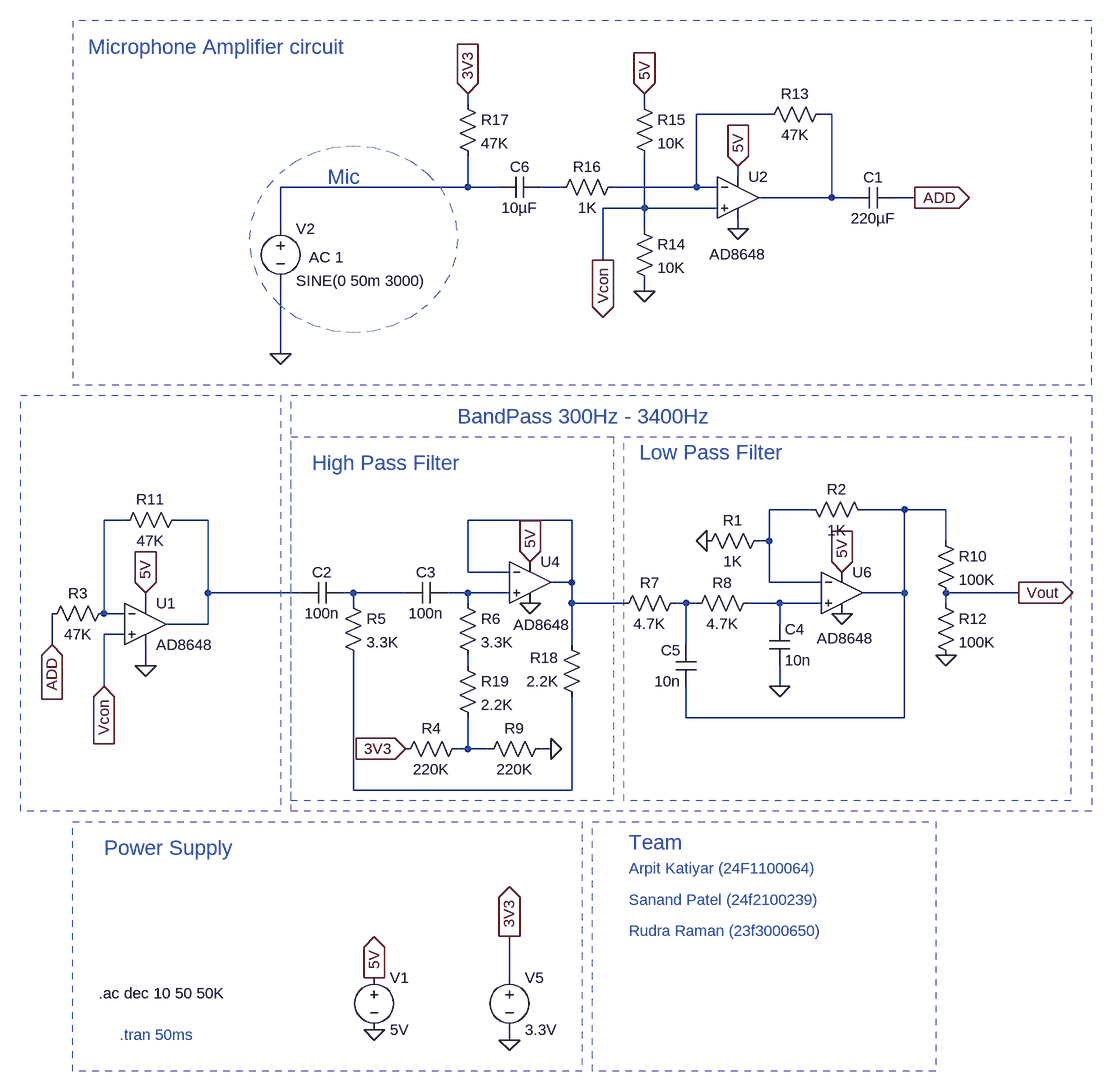
[diagram p0: schematic ESP_SIGNAL_CONDITIONING.asc]
ESP_SIGNAL_CONDITIONING.asc, the LTspice schematic file:
Version 4
SHEET 1 1856 948
WIRE 144 -1280 144 -1296
WIRE 416 -1280 416 -1296
WIRE 608 -1264 496 -1264
WIRE 704 -1264 688 -1264
WIRE 560 -1168 560 -1184
WIRE 144 -1152 144 -1200
WIRE 144 -1152 -144 -1152
WIRE 192 -1152 144 -1152
WIRE 288 -1152 256 -1152
WIRE 496 -1152 496 -1264
WIRE 496 -1152 368 -1152
WIRE 528 -1152 496 -1152
WIRE 704 -1136 704 -1264
WIRE 704 -1136 592 -1136
WIRE 736 -1136 704 -1136
WIRE 832 -1136 800 -1136
WIRE 416 -1120 416 -1200
WIRE 416 -1120 352 -1120
WIRE 528 -1120 416 -1120
WIRE -144 -1088 -144 -1152
WIRE 416 -1088 416 -1120
WIRE 560 -1088 560 -1104
WIRE 352 -1040 352 -1120
WIRE 416 -992 416 -1008
WIRE -144 -896 -144 -1008
WIRE 672 -656 608 -656
WIRE 816 -656 752 -656
WIRE 880 -656 816 -656
WIRE -384 -640 -416 -640
WIRE -256 -640 -304 -640
WIRE 304 -640 144 -640
WIRE 608 -608 608 -656
WIRE 608 -608 592 -608
WIRE 880 -608 880 -656
WIRE 144 -560 144 -640
WIRE 208 -560 144 -560
WIRE 304 -544 304 -640
WIRE 304 -544 272 -544
WIRE 608 -544 608 -608
WIRE 688 -544 608 -544
WIRE -256 -528 -256 -640
WIRE -112 -528 -256 -528
WIRE -32 -528 -48 -528
WIRE 48 -528 -32 -528
WIRE 144 -528 112 -528
WIRE 208 -528 144 -528
WIRE 816 -528 816 -656
WIRE 816 -528 752 -528
WIRE 992 -528 880 -528
WIRE -352 -512 -352 -528
WIRE -32 -512 -32 -528
WIRE 144 -512 144 -528
WIRE 304 -512 304 -544
WIRE 384 -512 304 -512
WIRE 480 -512 464 -512
WIRE 496 -512 480 -512
WIRE 624 -512 576 -512
WIRE 688 -512 624 -512
WIRE 880 -512 880 -528
WIRE -416 -496 -416 -640
WIRE -384 -496 -416 -496
WIRE -256 -480 -256 -528
WIRE -256 -480 -320 -480
WIRE 624 -480 624 -512
WIRE -384 -464 -416 -464
WIRE -496 -448 -496 -496
WIRE 304 -448 304 -512
WIRE 480 -448 480 -512
WIRE -352 -416 -352 -448
WIRE 144 -416 144 -432
WIRE -416 -384 -416 -464
WIRE 624 -384 624 -416
WIRE 480 -336 480 -384
WIRE 816 -336 816 -528
WIRE 816 -336 480 -336
WIRE 144 -288 144 -336
WIRE 144 -288 128 -288
WIRE 176 -288 144 -288
WIRE 272 -288 256 -288
WIRE -32 -224 -32 -432
WIRE 304 -224 304 -368
WIRE 304 -224 -32 -224
WIRE 208 64 208 0
WIRE 208 160 208 144
FLAG 0 144 0
FLAG 0 64 5V
IOPIN 0 64 Out
FLAG -144 -896 0
FLAG 240 -512 0
FLAG 720 -496 0
FLAG 240 -576 5V
IOPIN 240 -576 In
FLAG 720 -560 5V
IOPIN 720 -560 In
FLAG 992 -528 Vout
IOPIN 992 -528 Out
FLAG 512 -608 0
FLAG 624 -384 0
FLAG 880 -432 0
FLAG 560 -1088 0
FLAG 560 -1184 5V
IOPIN 560 -1184 In
FLAG 416 -992 0
FLAG 416 -1296 5V
IOPIN 416 -1296 In
FLAG 144 -1296 3V3
IOPIN 144 -1296 In
FLAG -352 -416 0
FLAG -352 -528 5V
IOPIN -352 -528 In
FLAG 832 -1136 ADD
IOPIN 832 -1136 Out
FLAG -496 -448 ADD
IOPIN -496 -448 In
FLAG 208 160 0
FLAG 208 0 3V3
IOPIN 208 0 Out
FLAG 352 -1040 Vcon
IOPIN 352 -1040 Out
FLAG -416 -384 Vcon
IOPIN -416 -384 In
FLAG 272 -288 0
FLAG 48 -288 3V3
IOPIN 48 -288 In
SYMBOL voltage 0 48 R0
WINDOW 123 0 0 Left 0
WINDOW 39 0 0 Left 0
SYMATTR InstName V1
SYMATTR Value 5V
SYMBOL res 656 -672 M90
WINDOW 0 0 56 VBottom 2
WINDOW 3 32 56 VTop 2
SYMATTR InstName R2
SYMATTR Value 1K
SYMBOL voltage -144 -1104 R0
WINDOW 123 44 60 Left 2
WINDOW 39 0 0 Left 0
SYMATTR Value2 AC 1
SYMATTR InstName V2
SYMATTR Value SINE(0 50m 3000)
SYMBOL res 496 -592 R270
WINDOW 0 32 56 VTop 2
WINDOW 3 0 56 VBottom 2
SYMATTR InstName R1
SYMATTR Value 1K
SYMBOL cap -48 -544 R90
WINDOW 0 0 32 VBottom 2
WINDOW 3 32 32 VTop 2
SYMATTR InstName C2
SYMATTR Value 100n
SYMBOL cap 112 -544 R90
WINDOW 0 0 32 VBottom 2
WINDOW 3 32 32 VTop 2
SYMATTR InstName C3
SYMATTR Value 100n
SYMBOL res -48 -528 R0
SYMATTR InstName R5
SYMATTR Value 3.3K
SYMBOL res 128 -528 R0
SYMATTR InstName R6
SYMATTR Value 3.3K
SYMBOL res 480 -528 R90
WINDOW 0 0 56 VBottom 2
WINDOW 3 32 56 VTop 2
SYMATTR InstName R7
SYMATTR Value 4.7K
SYMBOL res 592 -528 R90
WINDOW 0 0 56 VBottom 2
WINDOW 3 32 56 VTop 2
SYMATTR InstName R8
SYMATTR Value 4.7K
SYMBOL cap 608 -480 R0
SYMATTR InstName C4
SYMATTR Value 10n
SYMBOL cap 496 -384 R180
WINDOW 0 24 56 Left 2
WINDOW 3 24 8 Left 2
SYMATTR InstName C5
SYMATTR Value 10n
SYMBOL res 864 -624 R0
SYMATTR InstName R10
SYMATTR Value 100K
SYMBOL res 864 -528 R0
SYMATTR InstName R12
SYMATTR Value 100K
SYMBOL res 704 -1280 R90
WINDOW 0 0 56 VBottom 2
WINDOW 3 32 56 VTop 2
SYMATTR InstName R13
SYMATTR Value 47K
SYMBOL res 400 -1104 R0
SYMATTR InstName R14
SYMATTR Value 10K
SYMBOL res 400 -1296 R0
SYMATTR InstName R15
SYMATTR Value 10K
SYMBOL res 384 -1168 R90
WINDOW 0 0 56 VBottom 2
WINDOW 3 32 56 VTop 2
SYMATTR InstName R16
SYMATTR Value 1K
SYMBOL cap 256 -1168 R90
WINDOW 0 0 32 VBottom 2
WINDOW 3 32 32 VTop 2
SYMATTR InstName C6
SYMATTR Value 10µF
SYMBOL res 128 -1296 R0
SYMATTR InstName R17
SYMATTR Value 47K
SYMBOL OpAmps\\AD8648 560 -1200 R0
WINDOW 3 -44 151 Left 2
SYMATTR InstName U2
SYMBOL OpAmps\\AD8648 240 -608 R0
WINDOW 3 -26 129 Left 2
SYMATTR InstName U4
SYMBOL OpAmps\\AD8648 720 -592 R0
WINDOW 3 -39 134 Left 2
SYMATTR InstName U6
SYMBOL OpAmps\\AD8648 -352 -544 R0
SYMATTR InstName U1
SYMBOL res -400 -512 R90
WINDOW 0 0 56 VBottom 2
WINDOW 3 32 56 VTop 2
SYMATTR InstName R3
SYMATTR Value 47K
SYMBOL res -288 -656 R90
WINDOW 0 0 56 VBottom 2
WINDOW 3 32 56 VTop 2
SYMATTR InstName R11
SYMATTR Value 47K
SYMBOL cap 800 -1152 R90
WINDOW 0 0 32 VBottom 2
WINDOW 3 32 32 VTop 2
SYMATTR InstName C1
SYMATTR Value 220µF
SYMBOL voltage 208 48 R0
WINDOW 123 0 0 Left 0
WINDOW 39 0 0 Left 0
SYMATTR InstName V5
SYMATTR Value 3.3V
SYMBOL res 144 -304 R90
WINDOW 0 0 56 VBottom 2
WINDOW 3 32 56 VTop 2
SYMATTR InstName R4
SYMATTR Value 220K
SYMBOL res 272 -304 R90
WINDOW 0 0 56 VBottom 2
WINDOW 3 32 56 VTop 2
SYMATTR InstName R9
SYMATTR Value 220K
SYMBOL res 320 -352 R180
WINDOW 0 36 76 Left 2
WINDOW 3 36 40 Left 2
SYMATTR InstName R18
SYMATTR Value 2.2K
SYMBOL res 128 -432 R0
SYMATTR InstName R19
SYMATTR Value 2.2K
TEXT 408 -744 Left 3 ;Low Pass Filter
TEXT -96 -728 Left 3 ;High Pass Filter
TEXT -416 -136 Left 3 ;Power Supply
TEXT 392 -144 Left 3 ;Team
TEXT 392 -56 Left 2 ;Sanand Patel (24f2100239)
TEXT 392 -104 Left 2 ;Arpit Katiyar (24F1100064)
TEXT 392 -8 Left 2 ;Rudra Raman (23f3000650)
TEXT -72 -1168 Left 3 ;Mic
TEXT 128 -800 Left 3 ;BandPass 300Hz - 3400Hz
TEXT -392 152 Left 2 ;.tran 50ms
TEXT -440 -1368 Left 3 ;Microphone Amplifier circuit
TEXT -424 88 Left 2 !.ac dec 10 50 50K
RECTANGLE Normal 320 208 -464 -176 2
RECTANGLE Normal 864 208 336 -176 2
RECTANGLE Normal 368 -208 -128 -768 2
RECTANGLE Normal 1072 -208 384 -768 2
RECTANGLE Normal 1104 -192 -128 -832 2
RECTANGLE Normal 1104 -1408 -464 -848 2
RECTANGLE Normal -544 -832 -144 -192 2
CIRCLE Normal 128 -928 -192 -1216 2

The netlist it stands for:
* ESP_SIGNAL_CONDITIONING.asc
V1 5V 0 5V
R2 N005 N006 1K
V2 N003 0 SINE(0 50m 3000) AC 1
R1 0 N005 1K
C2 N010 N008 100n
C3 N011 N010 100n
R5 N010 N016 3.3K
R6 N011 N014 3.3K
R7 N012 N009 4.7K
R8 N013 N012 4.7K
C4 N013 0 10n
C5 N006 N012 10n
R10 N006 Vout 100K
R12 Vout 0 100K
R13 N002 N001 47K
R14 Vcon 0 10K
R15 5V Vcon 10K
R16 N001 N004 1K
C6 N004 N003 10µF
R17 3V3 N003 47K
XU2 Vcon N001 5V 0 N002 AD8648  ; pins In+ In- V+ V- OUT
XU4 N011 N009 5V 0 N009 AD8648  ; pins In+ In- V+ V- OUT
XU6 N013 N005 5V 0 N006 AD8648  ; pins In+ In- V+ V- OUT
XU1 Vcon N007 5V 0 N008 AD8648  ; pins In+ In- V+ V- OUT
R3 N007 ADD 47K
R11 N008 N007 47K
C1 ADD N002 220µF
V5 3V3 0 3.3V
R4 N015 3V3 220K
R9 0 N015 220K
R18 N016 N009 2.2K
R19 N014 N015 2.2K
* Low Pass Filter
* High Pass Filter
* Power Supply
* Team
* Sanand Patel (24f2100239)
* Arpit Katiyar (24F1100064)
* Rudra Raman (23f3000650)
* Mic
* BandPass 300Hz - 3400Hz
* .tran 50ms
* Microphone Amplifier circuit
.ac dec 10 50 50K
.lib ADI.lib
.backanno
.end